# EAGLE design Passive Filter PCB Design Large Board (EAGLE 9.6.2)
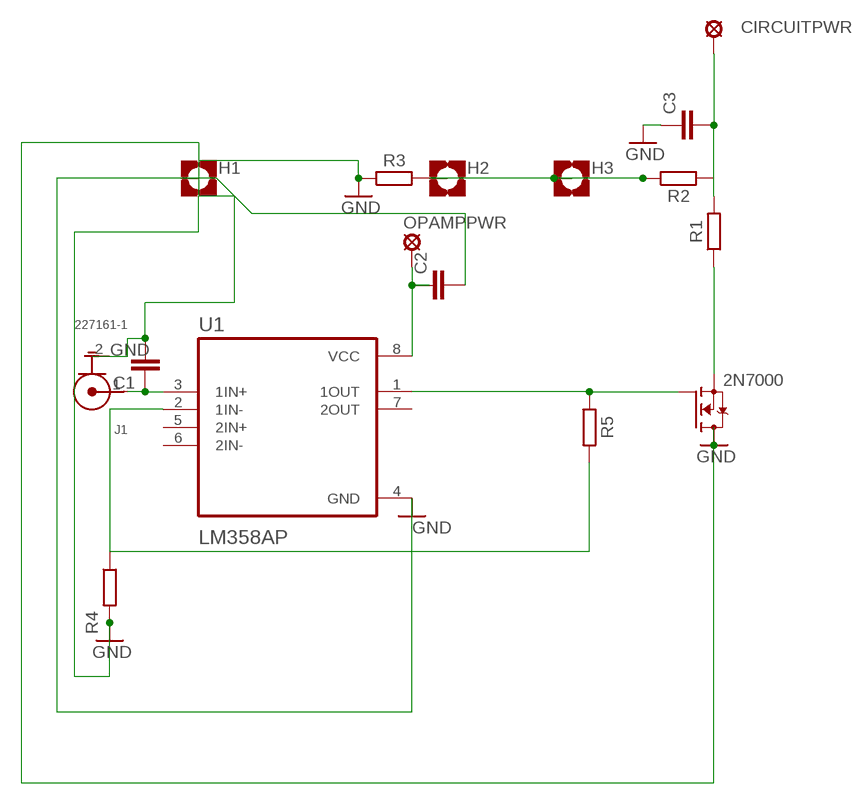
[diagram p0: schematic, sheet 1]

## Parts
C1  C5/3.5  [C5B3.5]
C2  C5/3.5  [C5B3.5]
C3  C5/3.5  [C5B3.5]
CIRCUITPWR  MCS10B  [MCS10B]
H1  MOUNT-PAD-SQUARE2.8  [2,8-PAD-SQUARE]
H2  MOUNT-PAD-SQUARE2.8  [2,8-PAD-SQUARE]
H3  MOUNT-PAD-SQUARE2.8  [2,8-PAD-SQUARE]
J1  227161-1  [TE_227161-1]
OPAMPPWR  LSP10  [LSP10]
R1  R_AXIAL-7.2MM-PITCH  [RESAD724W46L381D178B]
R2  R_AXIAL-7.2MM-PITCH  [RESAD724W46L381D178B]
R3  R_AXIAL-7.2MM-PITCH  [RESAD724W46L381D178B]
R4  R_AXIAL-7.2MM-PITCH  [RESAD724W46L381D178B]
R5  R_AXIAL-7.2MM-PITCH  [RESAD724W46L381D178B]
SHUNT  2N7000  [TO92-]
U1  LM358AP  [DIP794W45P254L959H508Q8]

## Nets
GND: C1.2 C2.2 C3.1 H1.B2,8(MOUNT) J1.2(G) R3.1 R4.2 SHUNT.1(D) U1.4(GND)
MOKU-IN: C1.1 J1.1(C) U1.3(1IN+)
N$1: R1.1 SHUNT.3(S)
N$3: H2.B2,8(MOUNT) H3.B2,8(MOUNT) R2.1 R3.2
N$4: C2.1 OPAMPPWR.MP U1.8(VCC)
N$5: R5.1 SHUNT.2(G) U1.1(1OUT)
N$7: R4.1 R5.2 U1.2(1IN-)
V+30V: C3.2 CIRCUITPWR.MP R1.2 R2.2
Unconnected: U1.5(2IN+) U1.6(2IN-) U1.7(2OUT)

## Library data of the parts
C1-C3 = capacitor-wima:C: CAPACITOR naming: grid - package width
CIRCUITPWR = solpad:MCS10B: SOLDER PAD MC S1, distributor Buerklin, 15F505
H1-H3 = holes:MOUNT-PAD-SQUARE: MOUNTING PAD, square
J1 = 227161-1:227161-1: CONN BNC JACK R/A 50 OHM PCB Check availability <https://pricing.snapeda.com/parts/227161-1/TE%20Connectivity/view-part?ref=eda>; AVAILABILITY: In Stock; COMMENT: 227161-1; DESCRIPTION: BNC Series 50 Ohm Right Angle Through Hole Jack Female Socket Connector; MF: TE Connectivity; MP: 227161-1; PACKAGE: None; PRICE: None; PURCHASE-URL: https://pricing.snapeda.com/search/part/227161-1/?ref=eda
OPAMPPWR = solpad:LSP10: SOLDER PAD drill 1.0 mm, distributor Buerklin, 12H555
R1-R5 = Resistor:R: Resistor Fixed - Generic; CATEGORY: Resistor; SUB-CATEGORY: Fixed
SHUNT = 2N7000:2N7000: Check availability <https://pricing.snapeda.com/parts/2N7000/STMicroelectronics/view-part?ref=eda>; AVAILABILITY: In Stock; DESCRIPTION: N-Channel 60 V 350mA (Tc) 1W (Tc) Through Hole TO-92-3; MF: STMicroelectronics; MP: 2N7000; PACKAGE: E-PKG AXIAL-LEADED-2 ON Semiconductor; PRICE: None; PURCHASE-URL: https://pricing.snapeda.com/search/part/2N7000/?ref=eda
U1 = LM358AP:LM358AP: Check availability <https://pricing.snapeda.com/parts/LM358AP/Texas%20Instruments/view-part?ref=eda>; AVAILABILITY: In Stock; DESCRIPTION: Dual, 30-V, 700-kHz, 3-mV offset voltage operational amplifier; MF: Texas Instruments; MP: LM358AP; PACKAGE: PDIP-8 Texas; PRICE: None; PURCHASE-URL: https://pricing.snapeda.com/search/part/LM358AP/?ref=eda

## Net classes
0 default: width 0.305 mm, drill 0.813 mm, clearance 0.254 mm

## Board
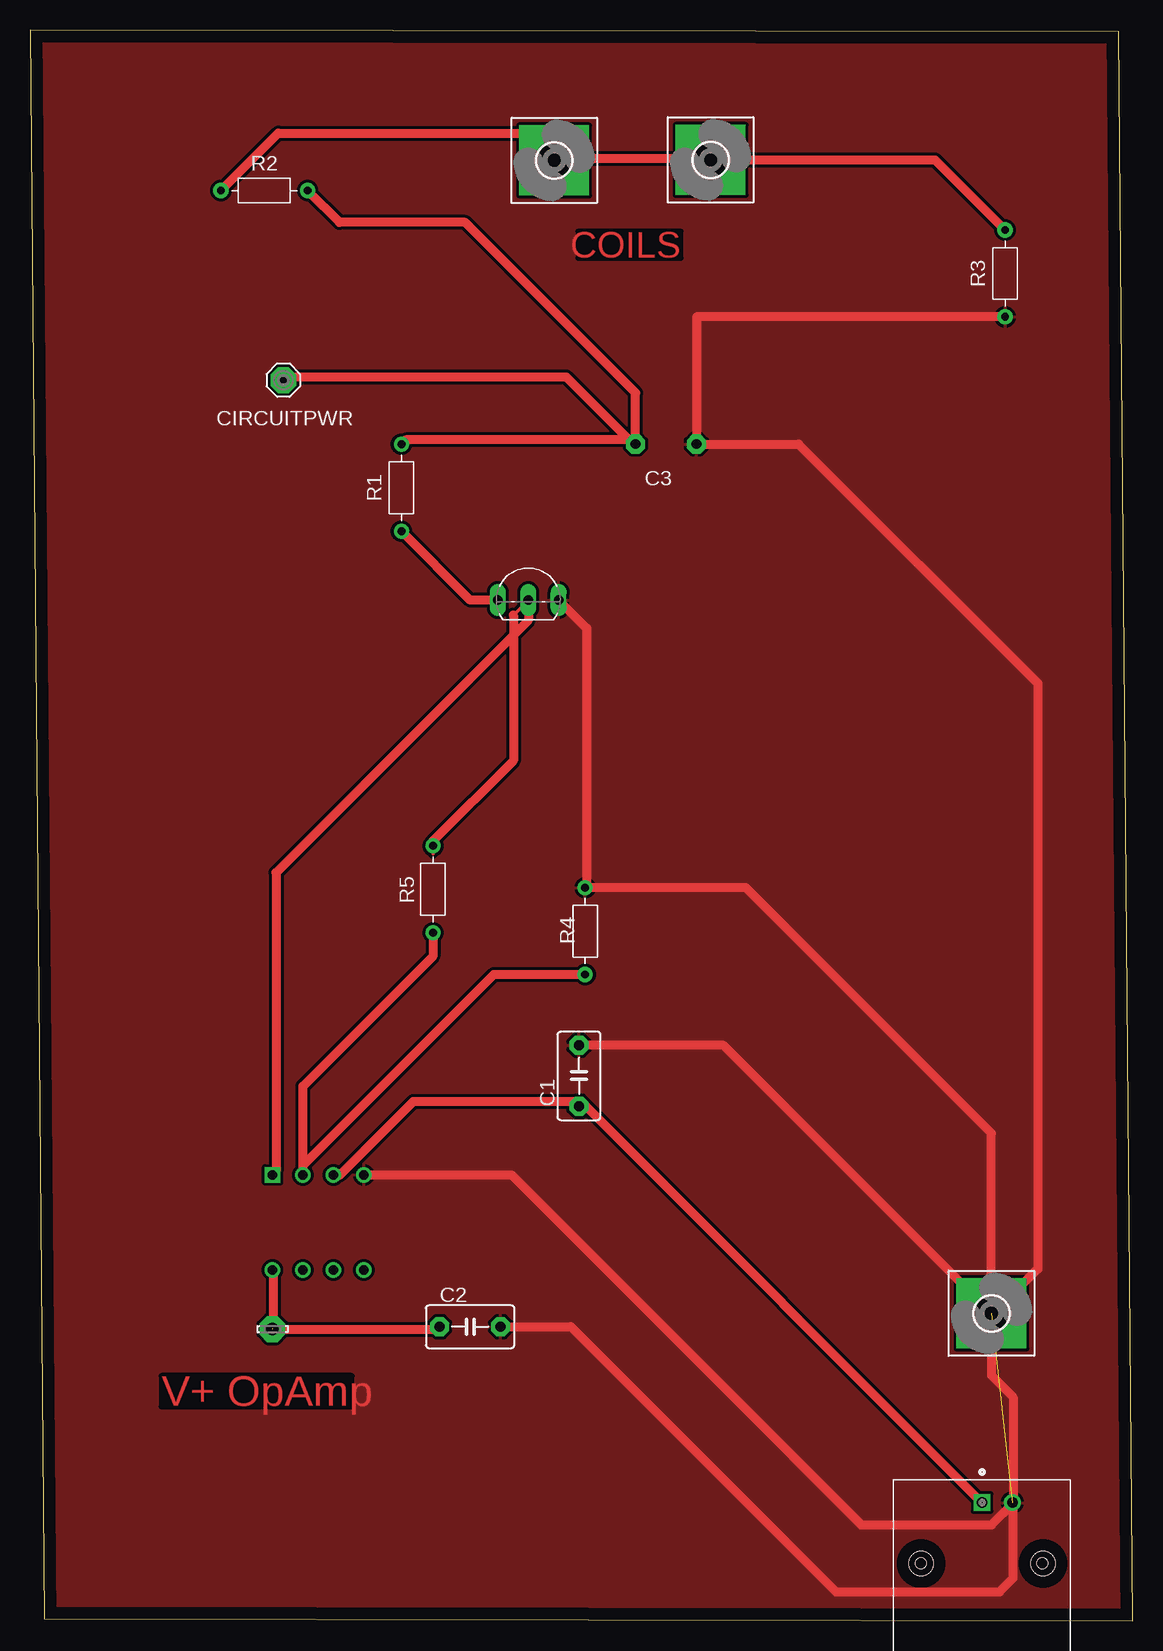
[diagram p1: board, top side]
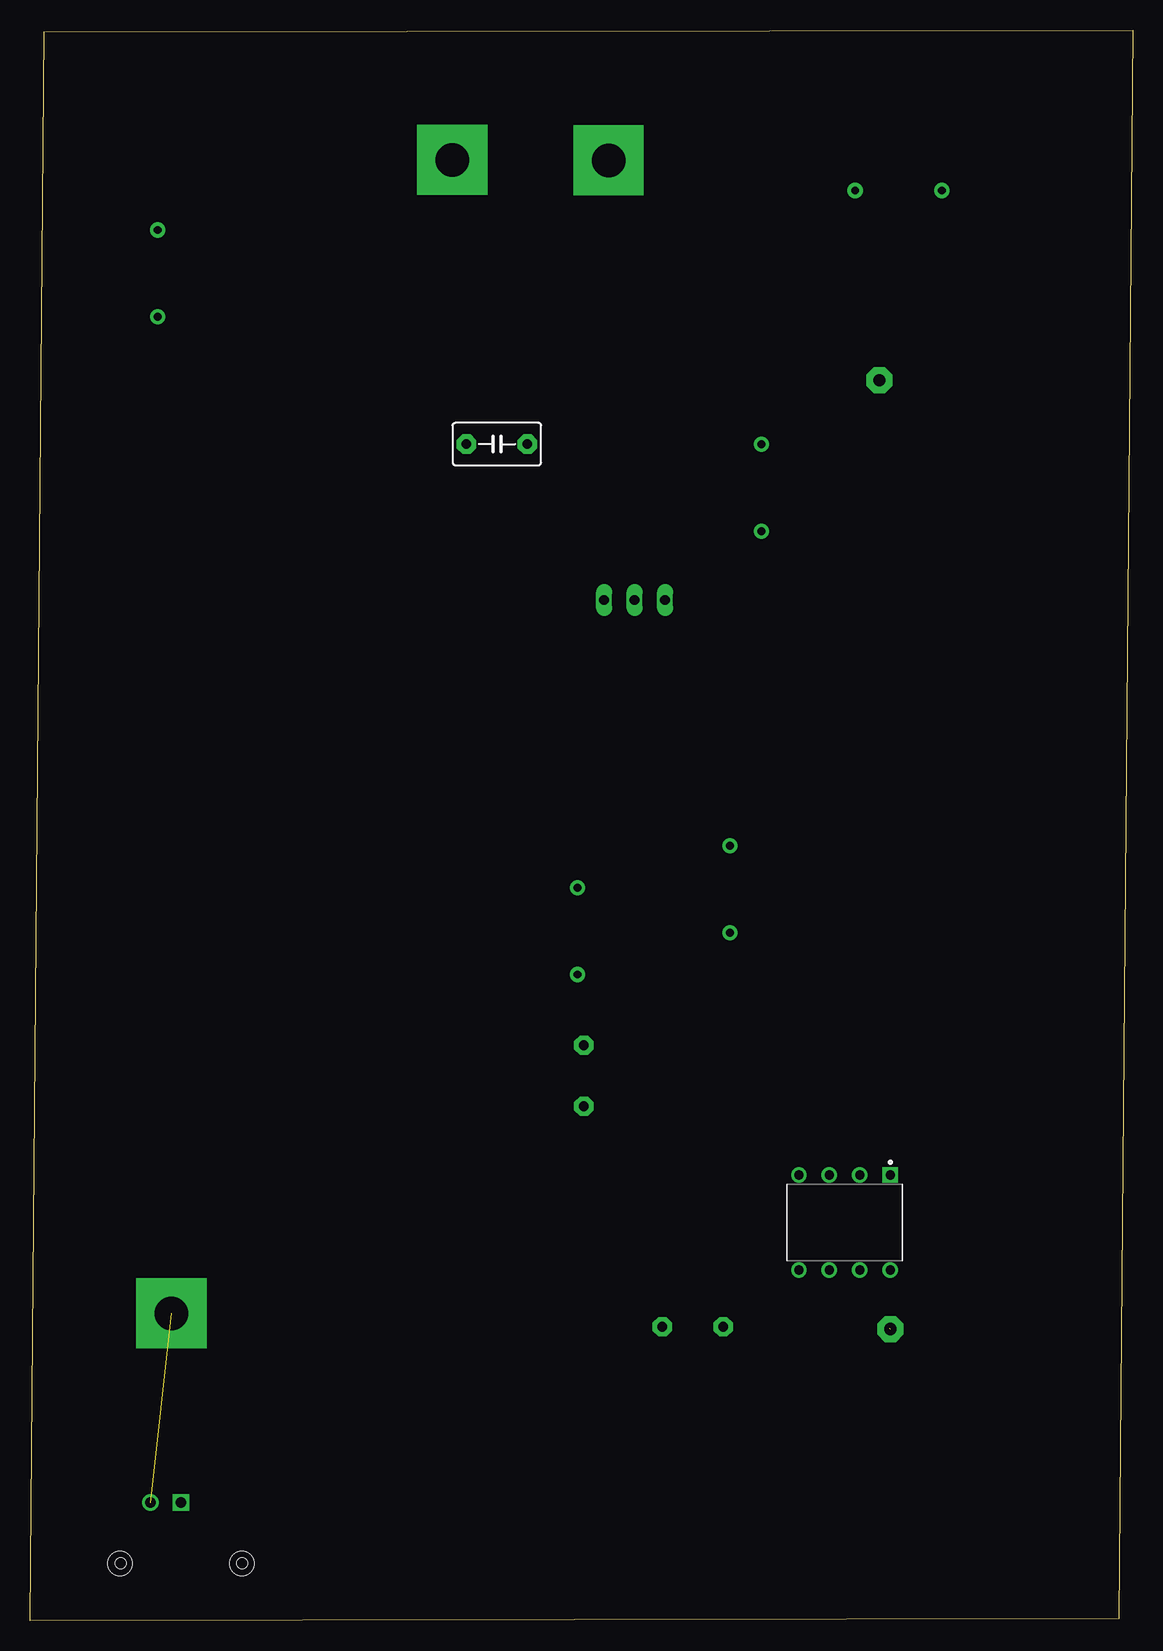
[diagram p2: board, bottom side, seen from below]

Size 91.95 x 132.57 mm. Coordinates in mm from the lower left corner, seen from the top.
Outline: 1.19,0.16 91.95,0 90.76,132.41 0,132.57 1.19,0.16
Copper layers (1*16): Top 0.035mm / dielectric 1.5mm / Bottom 0.035mm
Design rules "default": minimum track width 6mil, minimum drill 0.35mm, track to track 6mil, track to pad 6mil, pad to pad 6mil, via to via 6mil, smd to smd 6mil, copper to edge 40mil, drill to drill 6mil, minimum pad ring 10mil, minimum via ring 8mil, stop-mask expansion 4mil, vias tented up to drill 0mil, thermal gap 10mil
Holes 0.9 mm at 74.25,4.79 84.4,4.78

### Footprints (pad centres in the part's own frame; a part is rotated, then mirrored left to right if it is on the bottom)
C5B3.5 = drill 0.813 pad 1.6 octagon: 1 -2.54,0; 2 2.54,0
MCS10B = drill 1.016 pad 2.159 octagon: MP 0,0
2,8-PAD-SQUARE = drill 2.8 pad 5.842 square: B2,8 0,0
TE_227161-1 = drill 0.89 square: 1 0,0 | drill 0.89: 2 -2.54,0 | hole 2.01: -5.08,5.08; 5.08,5.08
LSP10 = drill 1.016 pad 2.159 octagon: MP 0,0
RESAD724W46L381D178B = drill 0.66 pad 1.26: 1 -3.62,0; 2 3.62,0
TO92- = drill 0.813 long: 1 2.54,0; 2 0,0; 3 -2.54,0
DIP794W45P254L959H508Q8 = drill 0.78 pad 1.13 square: 1 -3.97,3.81 | drill 0.78 pad 1.13: 2 -3.97,1.27; 3 -3.97,-1.27; 4 -3.97,-3.81; 5 3.97,-3.81; 6 3.97,-1.27; 7 3.97,1.27; 8 3.97,3.81

### Placement (x,y rotation side)
C1  45.78,45.41 90 top
C2  36.7,24.51 0 top
C3  53.02,98.06 0 bottom
CIRCUITPWR  21.12,103.38 0 top
H1  80.16,25.62 0 top
H2  43.7,121.7 0 top
H3  56.74,121.74 0 top
J1  79.37,9.85 180 top
OPAMPPWR  20.21,24.31 0 top
R1  30.97,94.42 90 top
R2  19.53,119.19 0 top
R3  81.29,112.28 90 top
R4  46.29,57.48 90 top
R5  33.59,60.95 270 top
SHUNT  41.54,85.06 0 top
U1  24.03,33.19 270 bottom

### Tracks (layer width: path | path; a pad name or v marks a point on that pad's centre or on a via)
GND  (1 unrouted)
  Top 0.305: R4.2 46.33,61.09 | R4.2 46.42,61.23 | R4.2 | H1.B2,8 80.16,25.46 | 81.98,9.81 81.98,9.92
  Top 0.737: 46.42,61.23 46.42,82.73 SHUNT.1 | R4.2 59.68,61.09 80.16,40.62 H1.B2,8 57.83,47.95 C1.2 | 81.98,9.92 81.98,18.63 80.16,20.45 80.16,25.46 84.03,29.34 84.03,78.11 64.08,98.06 C3.1 55.56,108.66 R3.1 | U1.4 40.14,37.16 69.31,7.99 80.16,7.99 81.98,9.81 81.98,3.58 80.81,2.42 67.19,2.42 45.1,24.51 C2.2
  pour Top: 1.1,132.64 92.11,132.64 92.11,0.33 1.1,0.33
MOKU-IN
  Top 0.305: U1.3 25.26,37.21 | 46.09,43.13 C1.1 45.38,43.27
  Top 0.737: J1.1 46.09,43.13 | U1.3 25.84,37.16 31.95,43.27 45.38,43.27
N$1
  Top 0.305: 38.91,84.96 SHUNT.3
  Top 0.737: SHUNT.3 36.7,85.06 R1.1
N$3
  Top 0.737: R2.1 20.69,123.96 41.44,123.96 H2.B2,8 43.83,121.83 56.65,121.83 H3.B2,8 75.45,121.74 R3.2
N$4  (1 unrouted)
  Top 0.305: 33.96,24.31 C2.1
  Top 0.737: U1.8 20.26,29.18 20.26,24.39 | OPAMPPWR.MP 33.96,24.31
N$5
  Top 0.305: 20.52,62.35 20.51,62.36 | 41.64,85.06 SHUNT.2 40.29,83.81 | 33.59,63.91 R5.1 | R5.1 33.5,64.47 | R5.1 33.59,64.98
  Top 0.737: U1.1 20.51,37.45 20.51,62.36 | SHUNT.2 41.54,83.38 20.52,62.35 | 33.59,64.98 40.29,71.68 40.29,83.81
N$7
  Top 0.305: U1.2 22.76,37.97
  Top 0.737: U1.2 22.76,44.55 33.59,55.38 R5.2 | R4.1 38.65,53.85 22.76,37.97
V+30V
  Top 0.737: CIRCUITPWR.MP 21.38,103.63 44.72,103.63 50.29,98.06 C3.2 | R1.2 31.35,98.41 50.13,98.41 C3.2 | C3.2 50.48,102.33 36.27,116.54 25.81,116.54 R2.2

### Text on the board
Top: COILS | V+ OpAmp